# Altium schematic sheet logi-cmos-7725-7670-NoFFC.SchDoc: PMOD Camera Adapter
size A; Engineer: Michael Jones; Revision: RA.1; ProjectName: OV7725
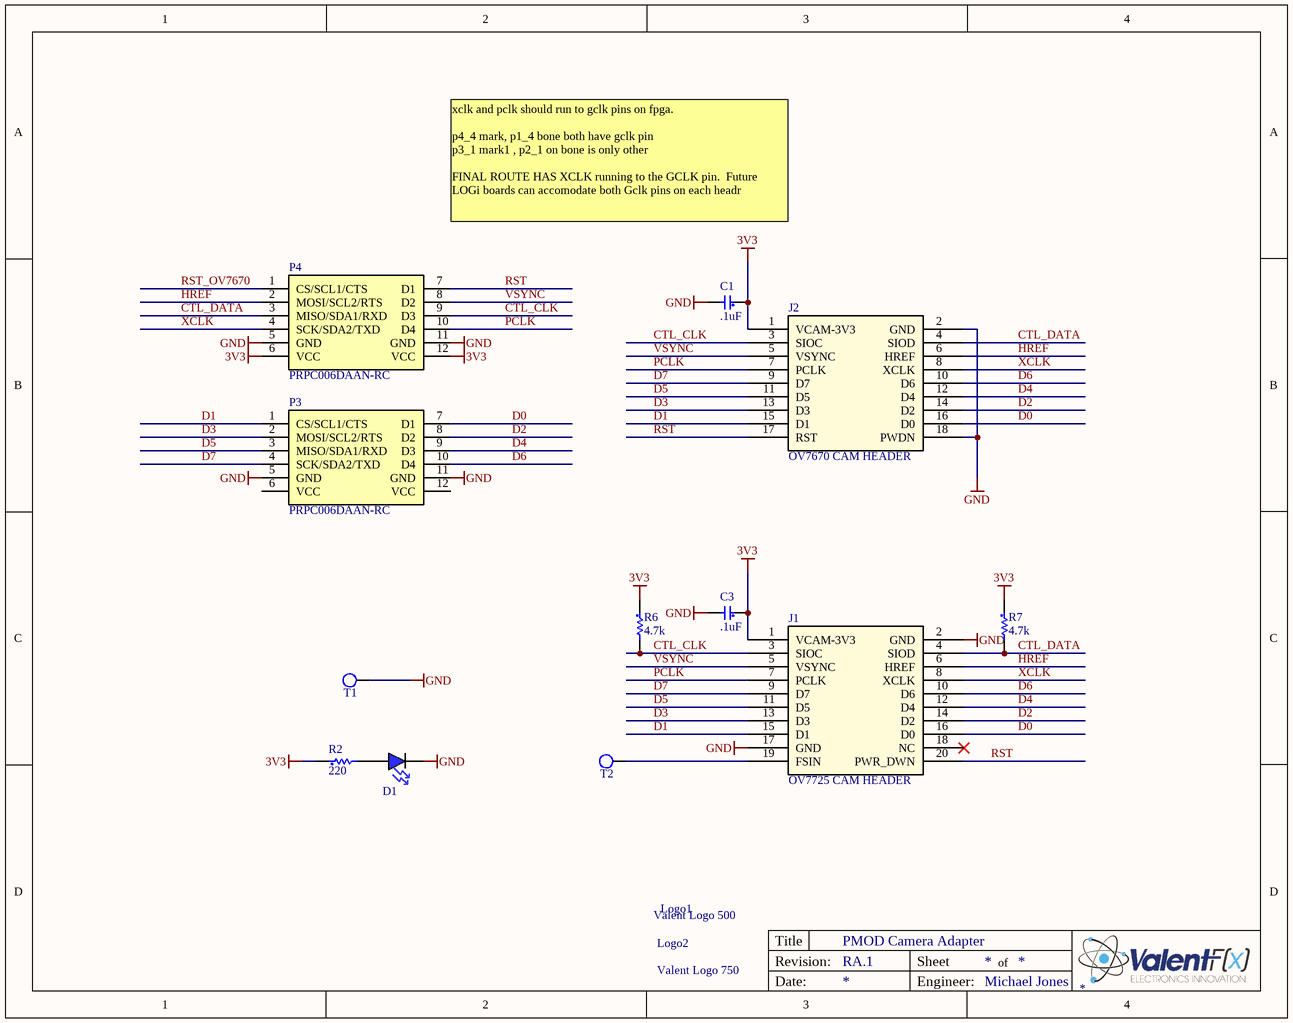
[diagram p0: logi-cmos-7725-7670-NoFFC.SchDoc]

## Parts
C1  .1uF  [C0603]
C3  .1uF  [C0603]
D1  BLUE LED0603  [LED_0603 - BLUE]  (value not drawn)
J1  OV7725 CAM HEADER  [HEADER_10x2_40_100 1-3-5 THRU DIP]
J2  OV7670 CAM HEADER  [HEADER_9x2_40_100 1-3-5 THRU DIP]
Logo1  Valent Logo 500  [VALENTFX_500-SolderMask]
Logo2  Valent Logo 750  [VALENTFX_750-SolderMask-BOT]
P3  PRPC006DAAN-RC  [PMOD HEADER - Male]
P4  PRPC006DAAN-RC  [PMOD HEADER - Male]
R2  220  [R0603]
R6  4.7k  [R0603]
R7  4.7k  [R0603]
T1  Test Point  [Tp 25-40]  (value not drawn)
T2  Test Point  [Tp 25-40]  (value not drawn)

## Nets
3V3: C1.1 C3.1 J1.1(VCAM-3V3) J2.1(VCAM-3V3) P4.6(VCC) P4.12(VCC) R2.1 R6.1 R7.1
GND: C1.2 C3.2 D1.C J1.2(GND) J1.17(GND) J2.2(GND) J2.18(PWDN) P3.5(GND) P3.11(GND) P4.5(GND) P4.11(GND) T1.1
CTL_CLK: J1.3(SIOC) J2.3(SIOC) P4.9(D3) R6.2
CTL_DATA: J1.4(SIOD) J2.4(SIOD) P4.3(MISO/SDA1/RXD) R7.2
D0: J1.16(D0) J2.16(D0) P3.7(D1)
D1: J1.15(D1) J2.15(D1) P3.1(CS/SCL1/CTS)
D2: J1.14(D2) J2.14(D2) P3.8(D2)
D3: J1.13(D3) J2.13(D3) P3.2(MOSI/SCL2/RTS)
D4: J1.12(D4) J2.12(D4) P3.9(D3)
D5: J1.11(D5) J2.11(D5) P3.3(MISO/SDA1/RXD)
D6: J1.10(D6) J2.10(D6) P3.10(D4)
D7: J1.9(D7) J2.9(D7) P3.4(SCK/SDA2/TXD)
HREF: J1.6(HREF) J2.6(HREF) P4.2(MOSI/SCL2/RTS)
PCLK: J1.7(PCLK) J2.7(PCLK) P4.10(D4)
RST: J1.20(PWR_DWN) J2.17(RST) P4.7(D1)
RST_OV7670: P4.1(CS/SCL1/CTS)
VSYNC: J1.5(VSYNC) J2.5(VSYNC) P4.8(D2)
XCLK: J1.8(XCLK) J2.8(XCLK) P4.4(SCK/SDA2/TXD)
NetD1_A: D1.A R2.2
NetJ1_19: J1.19(FSIN) T2.1

Not connected (* = marked no-connect by the designer): J1 18(NC)*; P3 6(VCC) 12(VCC)

## Notes on the sheet
- xclk and pclk should run to gclk pins on fpga.
  p4_4 mark, p1_4 bone both have gclk pin
  p3_1 mark1 , p2_1 on bone is only other
  FINAL ROUTE HAS XCLK running to the GCLK pin.  Future LOGi boards can accomodate both Gclk pins on each headr
- Title
- Revision:
- Sheet
- of
- Date:
- Engineer:

## Library data of the parts
C1 C3 = C0603 - C1608X7R1E104MT: .10uF X7R 20% (MLCC) - SMD/SMT 0603 25volts; Manufacturer: TDK; Capacitance: 0.1 uF; Supplier 1: Mouser; Manufacturer Part Number: C1608X7R1E104MT; RoHS: RoHS Compliant By Exemption; Category: Multilayer Ceramic Capacitors (MLCC) - SMD/SMT; Stock 1: 69148; Pricing 1: 1=0.365, 50=0.149, 100=0.085, 500=0.045, 1000=0.030, 4000=0.027, 8000=0.023, 12000=0.019, 20000=0.018 (AUD); Dimensions: 0.8 mm W x 1.6 mm L; Operating Temperature Range: - 55 C to + 125 C; Package / Case: 0603 (1608 metric); Packaging: Reel; Product: General Type MLCCs; Termination Style: SMD/SMT; Tolerance: 20 %; Voltage Rating: 25 Volts; Product Category: Low & Medium Capacitance SMD Ceramic Chip Capacitors; Standard Pack Qty: 4000.0; Temperature Coefficient / Code: X7R; RoHS - Mouser: E; Minimum Order Quantity: 1; Reeling: True; ComponentLink1URL: http://www.tdk.co.jp/tefe02/e411_c.pdf; ComponentLink1Description: http://www.tdk.co.jp/tefe02/e411_c.pdf; Supplier Part Number 1: 810-C1608X7R1E104M; Value: .1uF
D1 = LED0603 - HT-193NB-5589: BLUE Standard LED - SMD Blue 470nm 40mcd 20mA; Manufacturer: Harvatek International; LED Size: 0603; Lens Shape: Rectangular; Luminous Intensity: 45 mcd; Supplier 1: Mouser; Manufacturer Part Number: HT-193NB-5589; RoHS: RoHS Compliant; Category: Standard LED - SMD; Stock 1: 108922; Pricing 1: 1=0.203, 10=0.176, 50=0.135, 100=0.117, 500=0.101, 1000=0.085, 2000=0.068, 4000=0.068, 5000=0.059, 10000=0.051 (AUD); Illumination Color: Blue; Package / Case: 0603; Packaging: Reel; Wavelength: 470 nm; Lens Dimensions: 1 mm x 0.8 mm; Maximum Operating Temperature: + 80 C; Minimum Operating Temperature: - 30 C; Product Category: Surface Mount LEDs; RoHS - Mouser: Y; Minimum Order Quantity: 1; Reeling: True; ComponentLink1URL: http://harvatekchina.com/specification/HT-193NB.pdf; ComponentLink1Description: http://harvatekchina.com/specification/HT-193NB.pdf; Supplier Part Number 1: 743-HT-193NB-5589; Value: BLUE LED0603
J1 = CAM - 0V7725: CMOS CAMERA HEADER; Manufacturer: Sullins Connector Solutions; Manufacturer Part Number: SFH11-PBPC-D10-ST-BK; Description: CONN HEADR FMALE 20POS .1" DL AU; Number of Positions: 20; Number of Positions Loaded: All; Pitch: 0.100" (2.54mm); Value: SFH11-PBPC-D10-ST-BK; Supplier 1: Digi-Key; RoHS: RoHS Compliant; Category: Connectors, Interconnects; Stock 1: 2705; Pricing 1: 1=1.35, 10=1.121, 50=0.9338, 100=0.83, 250=0.72624, 500=0.664, 1000=0.60175, 2500=0.5395, 5000=0.52913 (USD); Packaging: Tray; Connector Type: Header; Contact Type: Female Socket; Number of Rows: 2; Row Spacing: 0.100" (2.54mm); Mounting Type: Through Hole; Termination: Solder; Fastening Type: -; Features: Polarizing Key; Contact Finish: Gold; Contact Finish Thickness: Flash; Color: Black; ComponentLink1URL: http://media.digikey.com/pdf/Data%20Sheets/Sullins%20PDFs/SFH11-PxxC-Dxx-ST-xx%2011160-C.pdf; ComponentLink1Description: http://media.digikey.com/pdf/Data%20Sheets/Sullins%20PDFs/SFH11-PxxC-Dxx-ST-xx%2011160-C.pdf; Supplier Part Number 1: S9197-ND
J2 = CAM - OV7670: CMOS CAMERA HEADER; Manufacturer: Sullins Connector Solutions; Manufacturer Part Number: PPPC092LFBN-RC; Description: CONN HEADER FMAL 18PS.1" DL GOLD; Number of Positions: 18; Number of Positions Loaded: All; Pitch: 0.100" (2.54mm); Value: PPPC092LFBN-RC; Supplier 1: Digi-Key; RoHS: RoHS Compliant; Category: Connectors, Interconnects; Stock 1: 3381; Pricing 1: 1=1.38, 10=1.145, 25=1.06, 50=0.954, 100=0.848, 250=0.742, 500=0.6784, 1000=0.6148, 2500=0.5512 (USD); Packaging: Bulk; Connector Type: Header; Contact Type: Female Socket; Number of Rows: 2; Row Spacing: 0.100" (2.54mm); Mounting Type: Through Hole; Termination: Solder; Fastening Type: -; Features: -; Contact Finish: Gold; Contact Finish Thickness: Flash; Color: Black; ComponentLink1URL: http://www.sullinscorp.com/drawings/78_P(N)PxCxxxLFBN-RC,_10492-G.pdf; ComponentLink1Description: http://www.sullinscorp.com/drawings/78_P(N)PxCxxxLFBN-RC,_10492-G.pdf; Supplier Part Number 1: S7112-ND
P3 P4 = P-MOD - MTSW-106-07-G-D-130-RA: Manufacturer: Samtec; Lead Time: 0 weeks; Peak Solder Temperature: 260 deg C; MSL (Moisture Sensitivity Level): N/R; Supplier 1: Arrow; Manufacturer Part Number: MTSW-106-07-G-D-130-RA; RoHS: CHINA ROHS: Compliant / EU ROHS: Compliant; Stock 1: 0; Termination Finish: Au/Ni; China ROHS Lead (X -> above / O -> below threshold): O; China ROHS Mercury (X -> above / O -> below threshold): O; China ROHS Cadmium (X -> above / O -> below threshold): O; China ROHS Hex Chromium (X -> above / O -> below threshold): O; China ROHS PBB (X -> above / O -> below threshold): O; China ROHS PBDE (X -> above / O -> below threshold): O; EU_ROHS_PROD_EXEMPTION_BY_SUPP: N/R; ComponentLink1URL: http://components.arrow.com/partservice/dataview/altium/2717179?apiKey=aa438727d59eed98c4bed826d8d949c84cb5e685b92bf87346a0226bd2658797; ComponentLink1Description: http://components.arrow.com/partservice/dataview/altium/2717179?apiKey=aa438727d59eed98c4bed826d8d949c84cb5e685b92bf87346a0226bd2658797; Supplier Part Number 1: 2717179; =Value: MTSW-106-07-G-D-130-RA; Value: PRPC006DAAN-RC
R2 = R0603 - ERJ-3EKF2200V: 220 - thick Film Resistors - SMD 0603 220ohms 1% Tol; Manufacturer: Panasonic - ECG; Power (Watts): 0.1W, 1/10W; Temperature Coefficient: ±100ppm/°C; Supplier 1: Digi-Key; Manufacturer Part Number: ERJ-3EKF2200V; RoHS: RoHS Compliant; Category: Resistors; Stock 1: 517798; Pricing 1: 1=0.1, 50=0.0138, 100=0.0105, 250=0.0078, 500=0.00576, 1000=0.00384 (USD); Resistance (Ohms): 220; Composition: Thick Film; Features: -; Tolerance: ±1%; Package / Case: 0603 (1608 Metric); Size / Dimension: 0.063" L x 0.031" W (1.60mm x 0.80mm); Height: 0.022" (0.55mm); Number of Terminations: 2; Packaging: Cut Tape (CT); ComponentLink1URL: http://industrial.panasonic.com/www-cgi/jvcr13pz.cgi?E+PZ+3+AOA0002+ERJ3EKF2200V+7+WW; ComponentLink1Description: http://industrial.panasonic.com/www-cgi/jvcr13pz.cgi?E+PZ+3+AOA0002+ERJ3EKF2200V+7+WW; Supplier Part Number 1: P220HCT-ND; Value: 220
R6 R7 = R0603 - CRCW06034K70FKEA: 4.7k Thick Film Resistors - SMD 1/10watt 4.7Kohms 1%; Manufacturer: Vishay Dale; Power (Watts): 0.1W, 1/10W; Temperature Coefficient: ±100ppm/°C; Supplier 1: Digi-Key; Manufacturer Part Number: CRCW06034K70FKEA; RoHS: RoHS Compliant; Category: Resistors; Stock 1: 51919; Pricing 1: 10=0.081, 50=0.0436, 200=0.0251, 1000=0.01711 (USD); Resistance (Ohms): 4.7K; Composition: Thick Film; Features: -; Tolerance: ±1%; Package / Case: 0603 (1608 Metric); Size / Dimension: 0.061" L x 0.033" W (1.55mm x 0.85mm); Height: 0.020" (0.50mm); Number of Terminations: 2; Packaging: Cut Tape (CT); ComponentLink1URL: http://www.vishay.com/doc?20035; ComponentLink1Description: http://www.vishay.com/doc?20035; Supplier Part Number 1: 541-4.70KHCT-ND; Value: 4.7k
T1 T2 = Test Point 2: Test Point Smaller Symbol